# EAGLE design circuit (EAGLE 6.4)
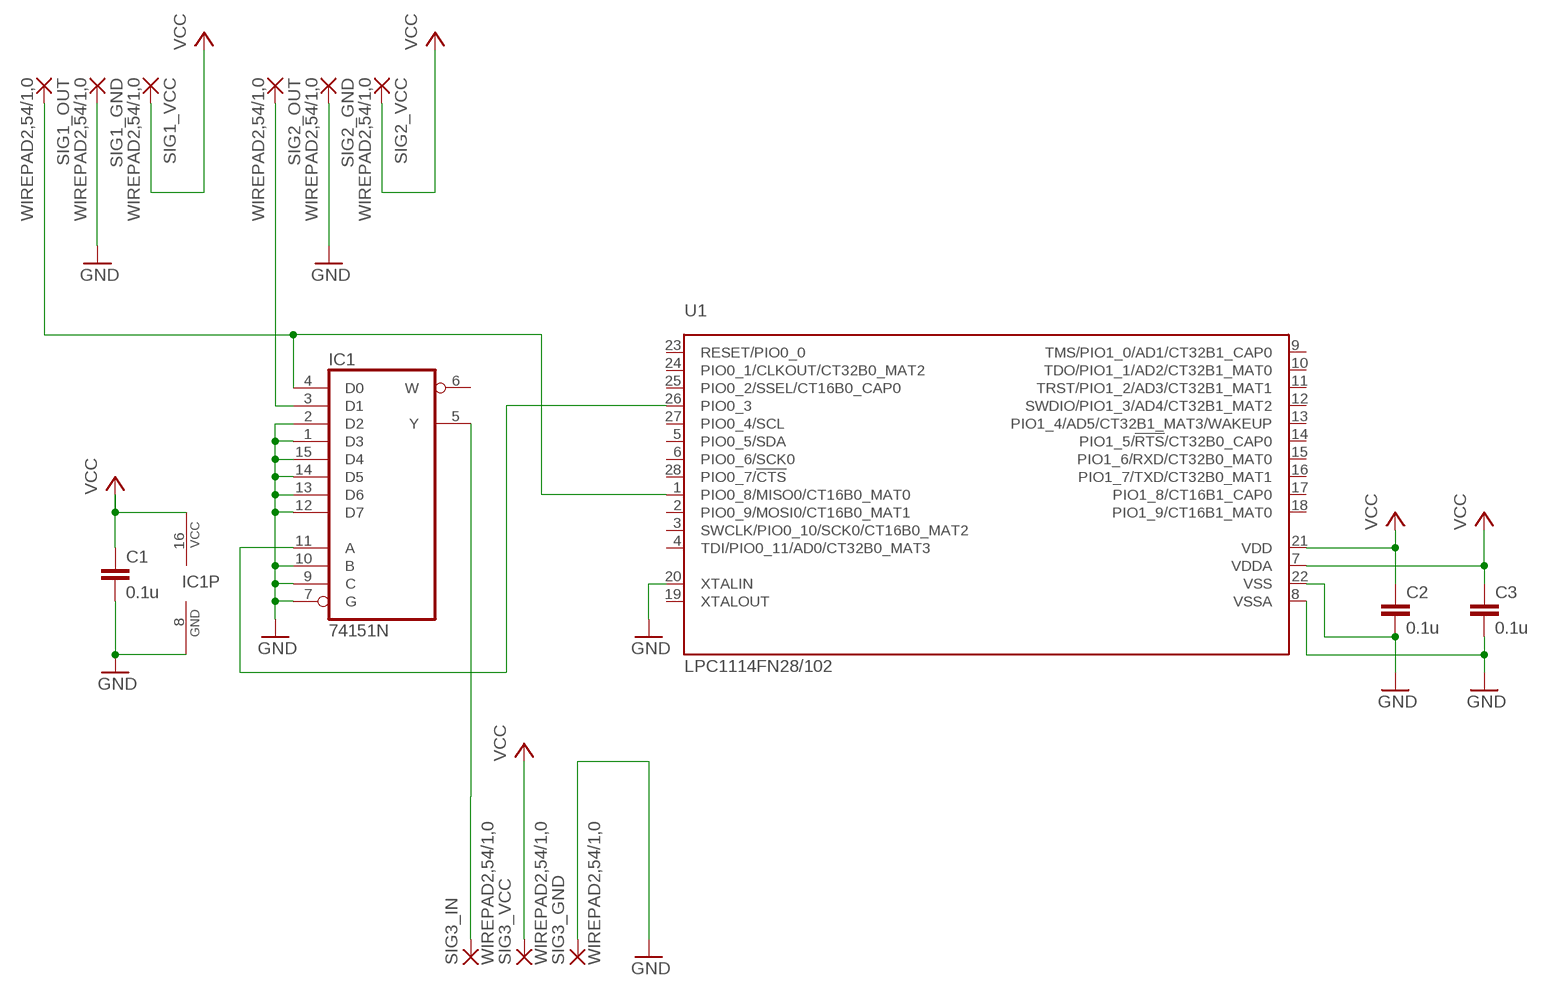
[diagram p0: schematic, sheet 1]

## Parts
C1  0.1u  C-EU025-024X044  [C025-024X044]
C2  0.1u  C-EU025-024X044  [C025-024X044]
C3  0.1u  C-EU025-024X044  [C025-024X044]
IC1  74151N  [DIL16]
SIG1_GND  WIREPAD2,54/1,0  [2,54/1,0]
SIG1_OUT  WIREPAD2,54/1,0  [2,54/1,0]
SIG1_VCC  WIREPAD2,54/1,0  [2,54/1,0]
SIG2_GND  WIREPAD2,54/1,0  [2,54/1,0]
SIG2_OUT  WIREPAD2,54/1,0  [2,54/1,0]
SIG2_VCC  WIREPAD2,54/1,0  [2,54/1,0]
SIG3_GND  WIREPAD2,54/1,0  [2,54/1,0]
SIG3_IN  WIREPAD2,54/1,0  [2,54/1,0]
SIG3_VCC  WIREPAD2,54/1,0  [2,54/1,0]
U1  LPC1114FN28/102  [SOT117]

## Nets
GND: C1.2 C2.2 C3.2 IC1.1(D3) IC1.2(D2) IC1.7(G) IC1.8(GND) IC1.9(C) IC1.10(B) IC1.12(D7) IC1.13(D6) IC1.14(D5) IC1.15(D4) SIG1_GND.1(P) SIG2_GND.1(P) SIG3_GND.1(P) U1.8(VSSA) U1.20(XTALIN) U1.22(VSS)
N$1: IC1.4(D0) SIG1_OUT.1(P) U1.1(PIO0_8/MISO0/CT16B0_MAT0)
N$2: IC1.11(A) U1.26(PIO0_3)
N$3: IC1.5(Y) SIG3_IN.1(P)
N$4: IC1.3(D1) SIG2_OUT.1(P)
VCC: C1.1 C2.1 C3.1 IC1.16(VCC) SIG1_VCC.1(P) SIG2_VCC.1(P) SIG3_VCC.1(P) U1.7(VDDA) U1.21(VDD)
Unconnected: IC1.6(W) U1.2(PIO0_9/MOSI0/CT16B0_MAT1) U1.3(SWCLK/PIO0_10/SCK0/CT16B0_MAT2) U1.4(TDI/PIO0_11/AD0/CT32B0_MAT3) U1.5(PIO0_5/SDA) U1.6(PIO0_6/SCK0) U1.9(TMS/PIO1_0/AD1/CT32B1_CAP0) U1.10(TDO/PIO1_1/AD2/CT32B1_MAT0) U1.11(TRST/PIO1_2/AD3/CT32B1_MAT1) U1.12(SWDIO/PIO1_3/AD4/CT32B1_MAT2) U1.13(PIO1_4/AD5/CT32B1_MAT3/WAKEUP) U1.14(PIO1_5/!RTS!/CT32B0_CAP0) U1.15(PIO1_6/RXD/CT32B0_MAT0) U1.16(PIO1_7/TXD/CT32B0_MAT1) U1.17(PIO1_8/CT16B1_CAP0) U1.18(PIO1_9/CT16B1_MAT0) U1.19(XTALOUT) U1.23(RESET/PIO0_0) U1.24(PIO0_1/CLKOUT/CT32B0_MAT2) U1.25(PIO0_2/SSEL/CT16B0_CAP0) U1.27(PIO0_4/SCL) U1.28(PIO0_7/!CTS!)

## Library data of the parts
C1-C3 = rcl:C-EU: CAPACITOR, European symbol
IC1 = 74xx-us:74*151: Data SELECTOR/MULTIPLEXER
SIG1_GND SIG1_OUT SIG1_VCC SIG2_GND SIG2_OUT SIG2_VCC SIG3_GND SIG3_IN SIG3_VCC = wirepad:WIREPAD: Wire PAD connect wire on PCB
U1 = nxp_60_1_1:LPC1114FN28: 32-bit ARM Cortex-M0 microcontroller; up to 64 kB flash and 8 kB SRAM The LPC1110/11/12/13/14/15 are a ARM Cortex-M0 based, low-cost 32-bit MCU family, designed for 8/16-bit microcontroller applications, offering performance, low power, simple instruction set and memory addressing together with reduced code size compared to existing 8/16-bit architectures. The LPC1110/11/12/13/14/15 operate at CPU frequencies of up to 50 MHz. The peripheral complement of the LPC1110/11/12/13/14/15 includes up to 64 kB of flash memory, up to 8 kB of data memory, one Fast-mode Plus I 2 C-bus interface, one RS-485/EIA-485 UART, up to two SPI interfaces with SSP features, four general purpose counter/timers, a 10-bit ADC, and up to 42 general purpose I/O pins. Remark: The LPC111x series consists of the LPC1100 series (parts LPC111x/101/201/301), LPC1100L series (parts LPC111x/002/102/202/302), and the LPC1100XL series (parts LPC111x/103/203/303/323/333). The LPC1100L and LPC1100XL series include the power profiles, a windowed watchdog timer, and a configurable open-drain mode. AAL Eindhoven MK; ADC: 6; FLASH: 32kB; GPIO: 22; PWR_PROFILES: yes; SERIES: LPC1100L; SPI: 1; SRAM: 4kB

## Board
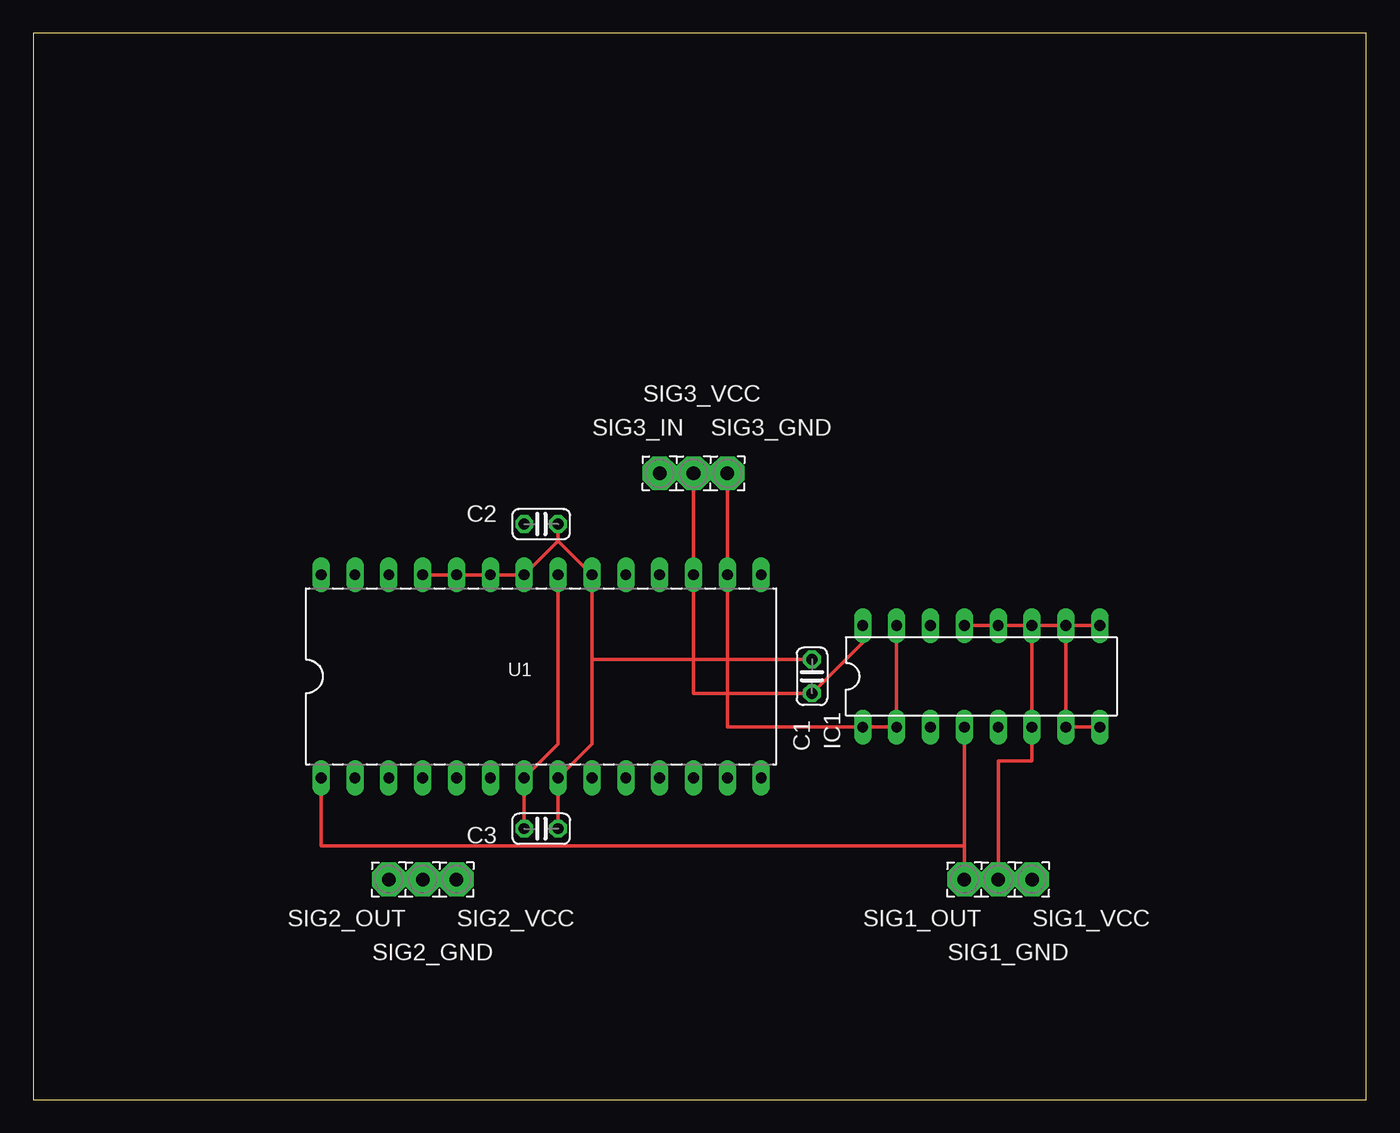
[diagram p1: board, top side]
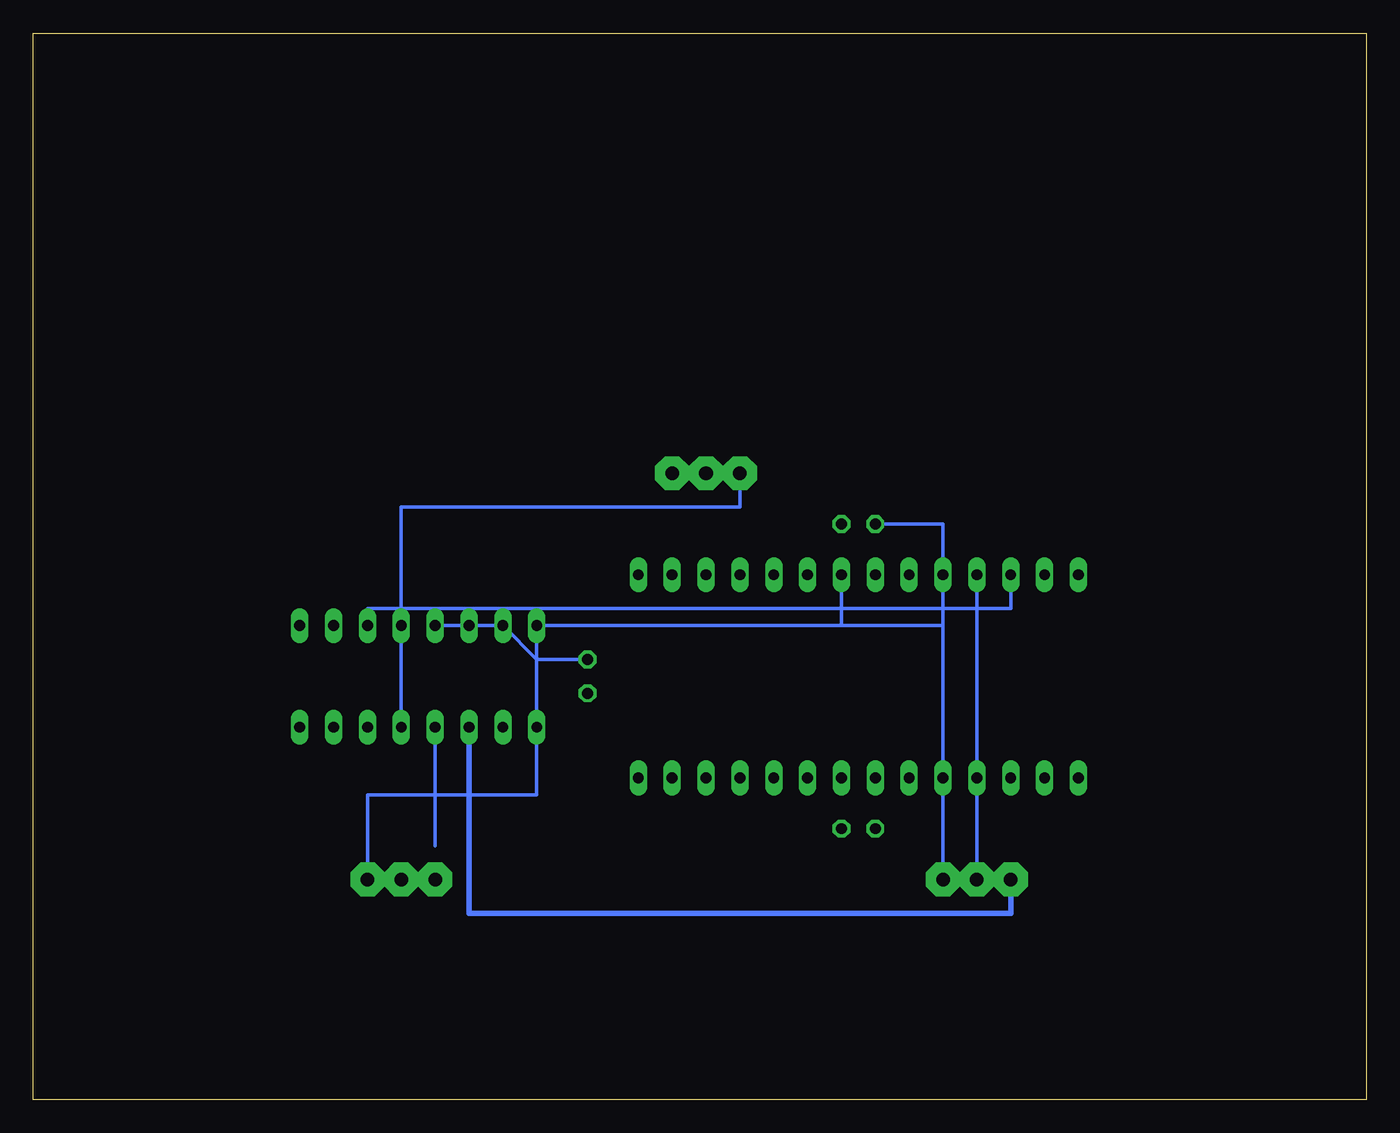
[diagram p2: board, bottom side, seen from below]

Size 100 x 80 mm. Coordinates in mm from the lower left corner, seen from the top.
Outline: 0,0 100,0 100,80 0,80 0,0
Copper layers (1*16): Top 0.035mm / dielectric 1.5mm / Bottom 0.035mm
Design rules "default": minimum track width 10mil, minimum drill 24mil, track to track 8mil, track to pad 8mil, pad to pad 8mil, via to via 8mil, smd to smd 8mil, copper to edge 40mil, drill to drill 8mil, minimum pad ring 10mil, minimum via ring 8mil, stop-mask expansion 4mil, vias tented up to drill 0mil, thermal gap 10mil

### Footprints (pad centres in the part's own frame; a part is rotated, then mirrored left to right if it is on the bottom)
C025-024X044 = drill 0.813 octagon: 1 -1.27,0; 2 1.27,0
DIL16 = drill 0.813 long: 1 -8.89,-3.81; 2 -6.35,-3.81; 3 -3.81,-3.81; 4 -1.27,-3.81; 5 1.27,-3.81; 6 3.81,-3.81; 7 6.35,-3.81; 8 8.89,-3.81; 9 8.89,3.81; 10 6.35,3.81; 11 3.81,3.81; 12 1.27,3.81; 13 -1.27,3.81; 14 -3.81,3.81; 15 -6.35,3.81; 16 -8.89,3.81
2,54/1,0 = drill 1.016 pad 2.54 octagon: 1 0,0
SOT117 = drill 0.813 long: 1 -16.51,-7.62; 2 -13.97,-7.62; 3 -11.43,-7.62; 4 -8.89,-7.62; 5 -6.35,-7.62; 6 -3.81,-7.62; 7 -1.27,-7.62; 8 1.27,-7.62; 9 3.81,-7.62; 10 6.35,-7.62; 11 8.89,-7.62; 12 11.43,-7.62; 13 13.97,-7.62; 14 16.51,-7.62; 15 16.51,7.62; 16 13.97,7.62; 17 11.43,7.62; 18 8.89,7.62; 19 6.35,7.62; 20 3.81,7.62; 21 1.27,7.62; 22 -1.27,7.62; 23 -3.81,7.62; 24 -6.35,7.62; 25 -8.89,7.62; 26 -11.43,7.62; 27 -13.97,7.62; 28 -16.51,7.62

### Placement (x,y rotation side)
C1  58.42,31.75 90 top
C2  38.1,43.18 0 top
C3  38.1,20.32 0 top
IC1  71.12,31.75 0 top
SIG1_GND  72.39,16.51 0 top
SIG1_OUT  69.85,16.51 0 top
SIG1_VCC  74.93,16.51 0 top
SIG2_GND  29.21,16.51 0 top
SIG2_OUT  26.67,16.51 0 top
SIG2_VCC  31.75,16.51 0 top
SIG3_GND  52.07,46.99 0 top
SIG3_IN  46.99,46.99 0 top
SIG3_VCC  49.53,46.99 0 top
U1  38.1,31.75 0 top

### Tracks (layer width: path | path; a pad name or v marks a point on that pad's centre or on a via)
GND  (via drill 0.6)
  Top 0.254: IC1.8 IC1.7 IC1.10 | IC1.9 IC1.10 | IC1.13 IC1.12 74.93,35.56 | IC1.15 IC1.2 IC1.1 52.07,27.94 SIG3_GND.1 | 74.93,35.56 74.93,33.02 74.93,25.4 72.39,25.4 SIG1_GND.1 | 74.93,35.56 IC1.10 | 39.37,41.91 U1.22 v29.21,39.37 | C2.2 39.37,41.91 | C3.2 U1.8 41.91,26.67 41.91,33.02 | 41.91,33.02 C1.2 | 41.91,33.02 U1.20 39.37,41.91
  Bottom 0.254: IC1.13 IC1.14 IC1.15 62.23,33.02 C1.2 | v29.21,39.37 SIG2_GND.1
N$1  (1 unrouted)
  Top 0.254: U1.1 21.59,19.05 60.96,19.05 69.85,19.05 | IC1.4 SIG1_OUT.1
  Bottom 0.254: IC1.4 69.85,19.05
N$2
  Bottom 0.254: U1.26 26.67,36.83 74.93,36.83 IC1.11
N$3
  Bottom 0.254: IC1.5 72.39,44.45 46.99,44.45 SIG3_IN.1
N$4
  Bottom 0.406: IC1.3 67.31,16.51 67.31,13.97 26.67,13.97 SIG2_OUT.1
VCC
  Top 0.254: C3.1 U1.7 39.37,26.67 U1.21 | IC1.16 62.23,34.29 C1.1 49.53,30.48 SIG3_VCC.1
  Bottom 0.254: C2.1 31.75,43.18 31.75,35.56 | SIG2_VCC.1 31.75,35.56 | 31.75,35.56 39.37,35.56 | SIG1_VCC.1 74.93,22.86 62.23,22.86 IC1.16 39.37,35.56 | 39.37,35.56 U1.21